# EasyEDA schematic Schematic_Z-Controller_v.1.0.0.json
TITLE: Z-Controller by KOE; REV: 1.0.0; Date: 2022-12-26; Sheet: 1/1; Drawn By: Romych; Company: zx-pk.ru
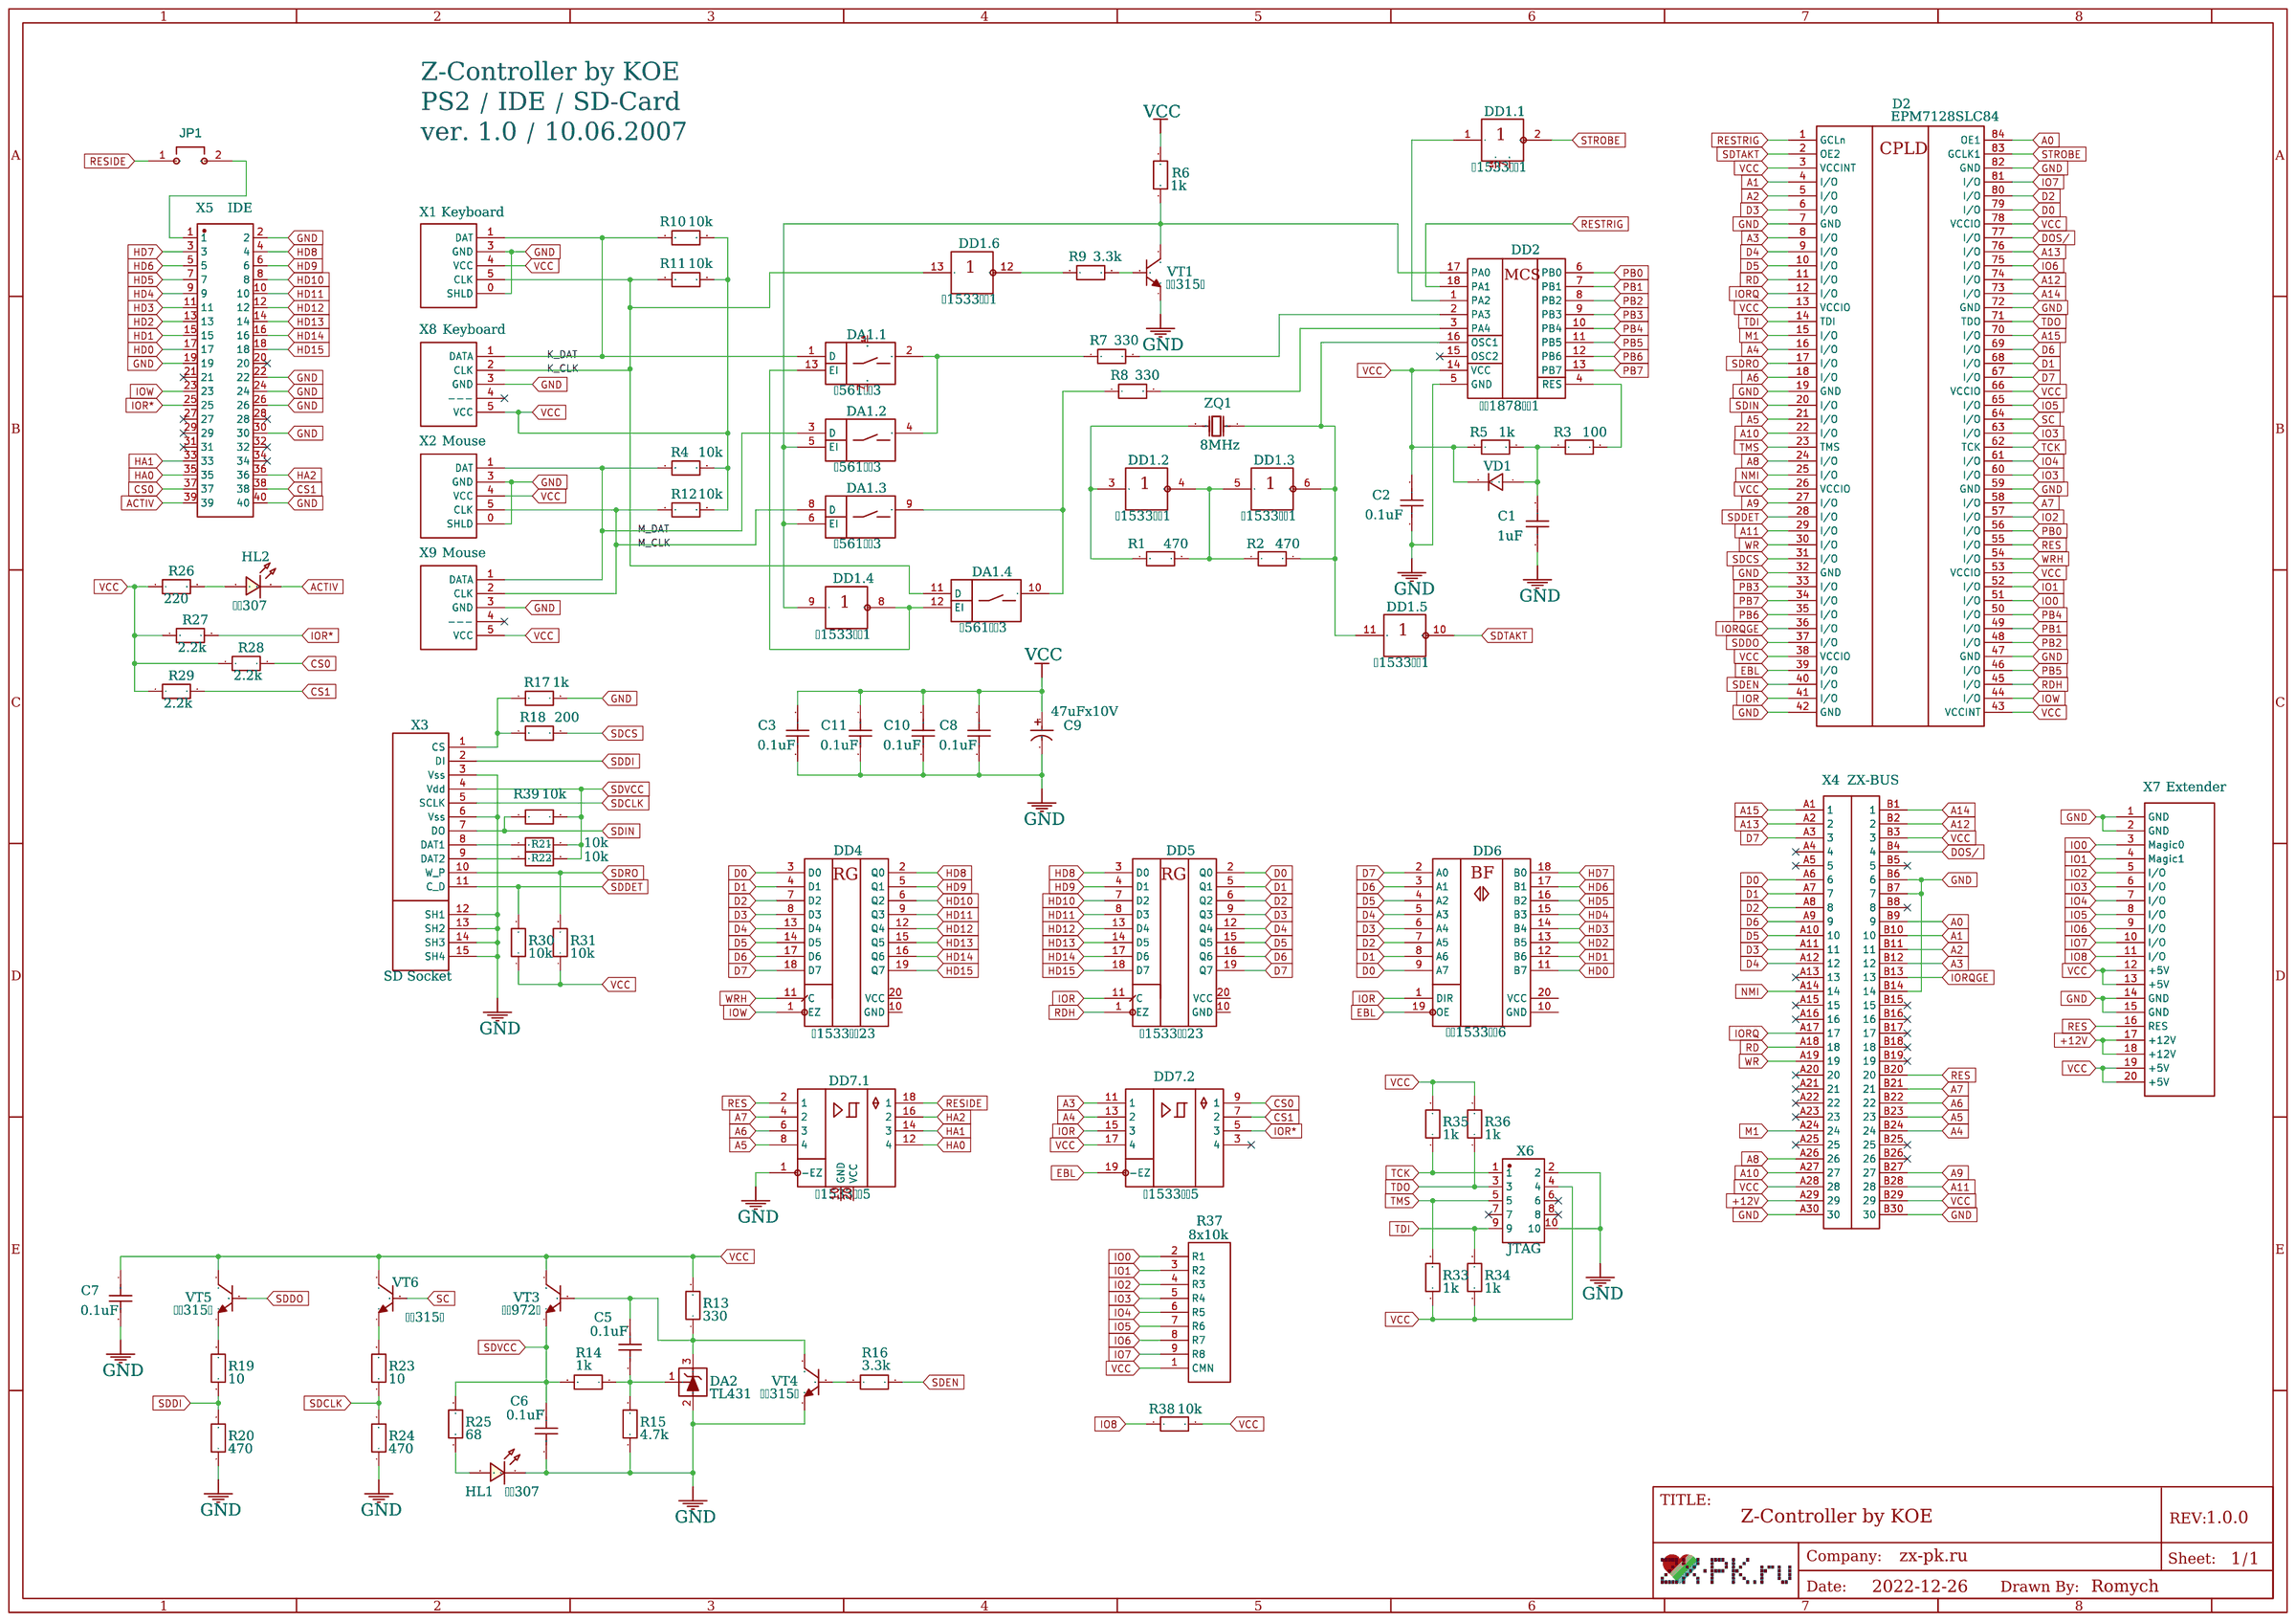
[diagram p0: schematic sheet]

## Parts
C1  1uF  [CAP-TH_L5.08]
C2  0.1uF  [CAP-TH_L5.08]
C3  0.1uF  [CAP-TH_L5.08]
C5  0.1uF  [CAP-TH_L5.08]
C6  0.1uF  [CAP-TH_L5.08]
C7  0.1uF  [CAP-TH_L5.08]
C8  0.1uF  [CAP-TH_L5.08]
C9  47uFx10V  [CAP-TH_BD6.3-P2.50-D1.0-FD]
C10  0.1uF  [CAP-TH_L5.08]
C11  0.1uF  [CAP-TH_L5.08]
D2  EPM7128SLC84  [PLCC-84-TH_STD]
DA1  К561КТ3  [DIP-14_STD]  (sections 1,2,3,4)
DA2  TL431  [TO-92-3_TL431_KOE]
DD1  К1533ЛН1  [DIP-14_STD]  (sections 1,2,3,4,5,6)
DD2  КР1878ВЕ1  [DIP-18_STD]
DD4  К1533ИР23  [DIP-20_STD]
DD5  К1533ИР23  [DIP-20_STD]
DD6  КР1533АП6  [DIP-20_STD]
DD7  К1533АП5  [DIP-20_STD]  (sections 1,2)
HL1  АЛ307  [D-TH_L2.54]
HL2  АЛ307  [D-TH_L2.54]
JP1  Jumper-2PM  [HDR-TH_2P-P2.54-V-M]
R1  470  [RES-TH_0.125_8.6]
R2  470  [RES-TH_0.125_8.6]
R3  100  [RES-TH_0.125_8.6]
R4  10k  [RES-TH_0.125_8.6]
R5  1k  [RES-TH_0.125_8.6]
R6  1k  [RES-TH_0.125_8.6]
R7  330  [RES-TH_0.125_8.6]
R8  330  [RES-TH_0.125_8.6]
R9  3.3k  [RES-TH_0.125_8.6]
R10  10k  [RES-TH_0.125_8.6]
R11  10k  [RES-TH_0.125_8.6]
R12  10k  [RES-TH_0.125_8.6]
R13  330  [RES-TH_0.125_8.6]
R14  1k  [RES-TH_0.125_8.6]
R15  4.7k  [RES-TH_0.125_8.6]
R16  3.3k  [RES-TH_0.125_8.6]
R17  1k  [RES-TH_0.125_8.6]
R18  200  [RES-TH_0.125_8.6]
R19  10  [RES-TH_0.125_8.6]
R20  470  [RES-TH_0.125_8.6]
R21  10k  [RES-TH_0.125_8.6]
R22  10k  [RES-TH_0.125_8.6]
R23  10  [RES-TH_0.125_8.6]
R24  470  [RES-TH_0.125_8.6]
R25  68  [RES-TH_0.125_8.6]
R26  220  [RES-TH_0.125_8.6]
R27  2.2k  [RES-TH_0.125_8.6]
R28  2.2k  [RES-TH_0.125_8.6]
R29  2.2k  [RES-TH_0.125_8.6]
R30  10k  [RES-TH_0.125_8.6]
R31  10k  [RES-TH_0.125_8.6]
R33  1k  [RES-TH_0.125_8.6]
R34  1k  [RES-TH_0.125_8.6]
R35  1k  [RES-TH_0.125_8.6]
R36  1k  [RES-TH_0.125_8.6]
R37  8x10k  [HDR-TH_9P-P2.54-V-F]
R38  10k  [RES-TH_0.125_8.6]
R39  10k  [RES-TH_0.125_8.6]
VD1  1N4148  [DIODE_TH_7.62]
VT1  КТ315Б  [KT315_STD]
VT3  КТ972Б  [KT315_STD]
VT4  КТ315Б  [KT315_STD]
VT5  КТ315Б  [KT315_STD]
VT6  КТ315Б  [KT315_STD]
X1  Keyboard  [PS2-TH_6P-KBD]
X2  Mouse  [PS2-TH_6P-KBD]
X3  SD Socket  [SD_SHORT]
X4  ZX-BUS  [SL60-SLOT-2.54-LONG]
X5  IDE  [CONN-TH_40P-P2.54_MTFD10-40B1]
X6  JTAG  [IDC-TH_10P-P2.54-V-R2-C5-S2.54]
X7  Extender  [HDR-TH_2X10P_P2.54]
X8  Keyboard  [HDR-TH_5P-P2.54]
X9  Mouse  [HDR-TH_5P-P2.54]
ZQ1  8MHz  [OSC-49U-1]

## Library data of the parts
C1-C3 C5-C8 C10 C11 = CK45-R3AD152K-VRY: Supplier: LCSC; Supplier Part: C340608; Manufacturer: TDK; Contributor: LCSC
C9 = ECLJ0612220M101P00: Supplier: LCSC; Supplier Part: C156809; Manufacturer: Guangdong TOPAZ Elec Tech; Contributor: LCSC
D2 = EPM7128SLC84: Supplier: chipdip; Contributor: romychs_4693
DA1 = К561КТ3: Supplier: chipdip; Contributor: romychs_4693; subpart_no: 1
DA2 = TL431ACLPREG: Supplier: LCSC; Supplier Part: C905425; Manufacturer: onsemi(安森美); link: https://atta.szlcsc.comnull; Contributor: LCSC
DD1 = К1533ЛН1: Supplier: chipdip; Contributor: Roman Boykov; subpart_no: 7
DD2 = КР1878ВЕ1: Supplier: chipdip; Contributor: Roman Boykov
DD4 DD5 = К1533ИР23: Supplier: chipdip; link: TTL; Регистр; ИР23; Contributor: romychs_4693
DD6 = КР1533АП6: Supplier: chipdip; Contributor: romychs_4693
DD7 = К1533АП5: Contributor: romychs_4693; subpart_no: 1
HL1 HL2 = LED-0603_R: Manufacturer: EVERLIGHT(台湾亿光); Manufacturer Part: 19-217/R6C-AL1M2VY/3T; Supplier Part: C72044; Supplier: LCSC; Contributor: LCEDA_01
JP1 = Jumper-2PM: Contributor: Roman Boykov
R1-R31 R33-R36 R38 R39 = RN 1/8W 470R F T/B A1: Supplier: LCSC; Supplier Part: C433478; Manufacturer: TyoHM; Contributor: LCSC
R37 = НР-8: Supplier: chipdip; Contributor: Roman Boykov
VD1 = 1N4148: Contributor: EasyEDA
VT1 VT3-VT6 = 2SC1815-TA: Supplier: LCSC; Manufacturer: CJ; image: //image.lceda.cn/szlcsc/C41114.jpg; Supplier Part: C41114; JLCPCB Part Class: Extended Part
X1 X2 = PS2-TH_STD: Supplier: chipdip; Contributor: Roman Boykov
X3 = SD_Socket_Short: Contributor: Roman Boykov
X4 = PinHeader_2x30: Contributor: Roman Boykov
X5 = MTFD10-40B1: Supplier: LCSC; Supplier Part: C376159; Manufacturer: MINTRON; Contributor: LCSC
X6 = X6521FV-2×05-C85D32: Supplier: LCSC; Supplier Part: C718231; Manufacturer: XKB Connectivity; Contributor: LCSC
X7 = PinHeader_2x10: Contributor: romychs_4693
X8 X9 = PinHeader_1x5: Contributor: Roman Boykov
ZQ1 = X49UD12MSD2SC: Supplier: LCSC; Manufacturer: YXC; Supplier Part: C2188

## Nets
+12V: X4.A29(29) X7.17(+12V) X7.18(+12V)
GND: C1.2 C2.2 C3.2 C6.2 C7.2 C8.2 C9.2 C10.2 C11.2 D2.7(GND) D2.19(GND) D2.32(GND) D2.42(GND) D2.47(GND) D2.59(GND) D2.72(GND) D2.82(GND) DA2.2(A) DD2.5(GND) DD7.1(-EZ) HL1.2 R15.1 R17.2 R20.1 R24.1 VT1.1(E) VT4.1(E) X1.0(SHLD) X1.3(GND) X2.0(SHLD) X2.3(GND) X3.3(Vss) X3.6(Vss) X3.12(SH1) X3.13(SH2) X3.14(SH3) X3.15(SH4) X4.A30(30) X4.B6(6) X4.B7(7) X4.B14(14) X4.B30(30) X5.2 X5.19 X5.22 X5.24 X5.26 X5.30 X5.40 X6.2 X6.10 X7.1(GND) X7.2(GND) X7.14(GND) X7.15(GND) X8.3(GND) X9.3(GND)
VCC: C2.1 C3.1 C7.1 C8.1 C9.1 C10.1 C11.1 D2.3(VCCINT) D2.13(VCCIO) D2.26(VCCIO) D2.38(VCCIO) D2.43(VCCINT) D2.53(VCCIO) D2.66(VCCIO) D2.78(VCCIO) DD2.14(VCC) DD7.17(4) R4.2 R5.1 R6.2 R10.2 R11.2 R12.2 R13.2 R26.1 R27.1 R28.1 R29.1 R30.1 R31.1 R33.1 R34.1 R35.2 R36.2 R37.1(CMN) R38.2 VD1.2(K) VT3.2(C) VT5.2(C) VT6.2(C) X1.4(VCC) X2.4(VCC) X4.A28(28) X4.B3(3) X4.B29(29) X6.4 X7.12(+5V) X7.13(+5V) X7.19(+5V) X7.20(+5V) X8.5(VCC) X9.5(VCC)
A0: D2.84(OE1) X4.B9(9)
A1: D2.4(I/O) X4.B10(10)
A2: D2.5(I/O) X4.B11(11)
A3: D2.8(I/O) DD7.11(1) X4.B12(12)
A4: D2.16(I/O) DD7.13(2) X4.B24(24)
A5: D2.21(I/O) DD7.8(4) X4.B23(23)
A6: D2.18(I/O) DD7.6(3) X4.B22(22)
A7: D2.58(I/O) DD7.4(2) X4.B21(21)
A8: D2.24(I/O) X4.A26(26)
A9: D2.27(I/O) X4.B27(27)
A10: D2.22(I/O) X4.A27(27)
A11: D2.29(I/O) X4.B28(28)
A12: D2.74(I/O) X4.B2(2)
A13: D2.76(I/O) X4.A2(2)
A14: D2.73(I/O) X4.B1(1)
A15: D2.70(I/O) X4.A1(1)
ACTIV: HL2.2 X5.39
CS0: DD7.9(1) R28.2 X5.37
CS1: DD7.7(2) R29.2 X5.38
D0: D2.79(I/O) DD4.3(D0) DD5.2(Q0) DD6.9(A7) X4.A6(6)
D1: D2.68(I/O) DD4.4(D1) DD5.5(Q1) DD6.8(A6) X4.A7(7)
D2: D2.80(I/O) DD4.7(D2) DD5.6(Q2) DD6.7(A5) X4.A8(8)
D3: D2.6(I/O) DD4.8(D3) DD5.9(Q3) DD6.6(A4) X4.A11(11)
D4: D2.9(I/O) DD4.13(D4) DD5.12(Q4) DD6.5(A3) X4.A12(12)
D5: D2.10(I/O) DD4.14(D5) DD5.15(Q5) DD6.4(A2) X4.A10(10)
D6: D2.69(I/O) DD4.17(D6) DD5.16(Q6) DD6.3(A1) X4.A9(9)
D7: D2.67(I/O) DD4.18(D7) DD5.19(Q7) DD6.2(A0) X4.A3(3)
DOS/: D2.77(I/O) X4.B4(4)
EBL: D2.39(I/O) DD6.19(OE) DD7.19(-EZ)
HA0: DD7.12(4) X5.35
HA1: DD7.14(3) X5.33
HA2: DD7.16(2) X5.36
HD0: DD6.11(B7) X5.17
HD1: DD6.12(B6) X5.15
HD2: DD6.13(B5) X5.13
HD3: DD6.14(B4) X5.11
HD4: DD6.15(B3) X5.9
HD5: DD6.16(B2) X5.7
HD6: DD6.17(B1) X5.5
HD7: DD6.18(B0) X5.3
HD8: DD4.2(Q0) DD5.3(D0) X5.4
HD9: DD4.5(Q1) DD5.4(D1) X5.6
HD10: DD4.6(Q2) DD5.7(D2) X5.8
HD11: DD4.9(Q3) DD5.8(D3) X5.10
HD12: DD4.12(Q4) DD5.13(D4) X5.12
HD13: DD4.15(Q5) DD5.14(D5) X5.14
HD14: DD4.16(Q6) DD5.17(D6) X5.16
HD15: DD4.19(Q7) DD5.18(D7) X5.18
IO0: D2.51(I/O) R37.2(R1) X7.3(Magic0)
IO1: D2.52(I/O) R37.3(R2) X7.4(Magic1)
IO2: D2.57(I/O) R37.4(R3) X7.5(I/O)
IO3: D2.60(I/O) D2.63(I/O) R37.5(R4) X7.6(I/O)
IO4: D2.61(I/O) R37.6(R5) X7.7(I/O)
IO5: D2.65(I/O) R37.7(R6) X7.8(I/O)
IO6: D2.75(I/O) R37.8(R7) X7.9(I/O)
IO7: D2.81(I/O) R37.9(R8) X7.10(I/O)
IO8: R38.1 X7.11(I/O)
IOR: D2.41(I/O) DD5.11(C) DD6.1(DIR) DD7.15(3)
IOR*: DD7.5(3) R27.2 X5.25
IORQ: D2.12(I/O) X4.A17(17)
IORQGE: D2.36(I/O) X4.B13(13)
IOW: D2.44(I/O) DD4.1(EZ) X5.23
K_CLK: DA1.11(D) DD1.13(1) R11.1 X1.5(CLK) X8.2(CLK)
K_DAT: DA1.1(D) R10.1 X1.1(DAT) X8.1(DATA)
M1: D2.15(I/O) X4.A24(24)
M_CLK: DA1.8(D) R12.1 X2.5(CLK) X9.2(CLK)
M_DAT: DA1.3(D) R4.1 X2.1(DAT) X9.1(DATA)
NMI: D2.25(I/O) X4.A14(14)
PB0: D2.56(I/O) DD2.6(PB0)
PB1: D2.49(I/O) DD2.7(PB1)
PB2: D2.48(I/O) DD2.8(PB2)
PB3: D2.33(I/O) DD2.9(PB3)
PB4: D2.50(I/O) DD2.10(PB4)
PB5: D2.46(I/O) DD2.11(PB5)
PB6: D2.35(I/O) DD2.12(PB6)
PB7: D2.34(I/O) DD2.13(PB7)
RD: D2.11(I/O) X4.A18(18)
RDH: D2.45(I/O) DD5.1(EZ)
RES: D2.55(I/O) DD7.2(1) X4.B20(20) X7.16(RES)
RESIDE: DD7.18(1) JP1.1
RESTRIG: D2.1(GCLn) DD2.18(PA1)
SC: D2.64(I/O) VT6.3(B)
SDCLK: R23.1 R24.2 X3.5(SCLK)
SDCS: D2.31(I/O) R18.2
SDDET: D2.28(I/O) R30.2 X3.11(C_D)
SDDI: R19.1 R20.2 X3.2(DI)
SDDO: D2.37(I/O) VT5.3(B)
SDEN: D2.40(I/O) R16.1
SDIN: D2.20(I/O) R39.1 X3.7(DO)
SDRO: D2.17(I/O) R31.2 X3.10(W_P)
SDTAKT: D2.2(OE2) DD1.10(2)
SDVCC: C6.1 R14.2 R21.2 R22.2 R25.2 R39.2 VT3.1(E) X3.4(Vdd)
STROBE: D2.83(GCLK1) DD1.2
TCK: D2.62(TCK) R35.1 X6.1
TDI: D2.14(TDI) R34.2 X6.9
TDO: D2.71(TDO) R36.1 X6.3
TMS: D2.23(TMS) R33.2 X6.5
WR: D2.30(I/O) X4.A19(19)
WRH: D2.54(I/O) DD4.11(C)
Net-(C1-1): C1.1 R3.1 R5.2 VD1.1(A)
Net-(C5-1): C5.1 DA2.3(K) R13.1 VT3.3(B) VT4.2(C)
Net-(C5-2): C5.2 DA2.1(R) R14.1 R15.2
Net-(DA1.1-2): DA1.2(O) DA1.4(O) R7.1
Net-(DA1.1-13): DA1.12(EI) DA1.13(EI) DD1.8(2)
Net-(DA1.2-5): DA1.5(EI) DA1.6(EI) DD1.9(1) DD2.17(PA0) R6.1 VT1.2(C)
Net-(DA1.3-9): DA1.9(O) DA1.10(O) R8.1
Net-(DD1.1-1): DD1.1 DD2.1(PA2)
Net-(DD1.2-3): DD1.3(1) R1.1 ZQ1.2(OSC2)
Net-(DD1.2-4): DD1.4(2) DD1.5(1) R1.2 R2.1
Net-(DD1.3-6): DD1.6(2) DD1.11(1) DD2.16(OSC1) R2.2 ZQ1.1(OSC1)
Net-(DD1.6-12): DD1.12(2) R9.1
Net-(DD2-2): DD2.2(PA3) R7.2
Net-(DD2-3): DD2.3(PA4) R8.2
Net-(DD2-4): DD2.4(RES) R3.2
Net-(HL1-1): HL1.1 R25.1
Net-(HL2-1): HL2.1 R26.2
Net-(JP1-2): JP1.2 X5.1
Net-(R9-2): R9.2 VT1.3(B)
Net-(R16-2): R16.2 VT4.3(B)
Net-(R17-1): R17.1 R18.1 X3.1(CS)
Net-(R19-2): R19.2 VT5.1(E)
Net-(R21-1): R21.1 X3.8(DAT1)
Net-(R22-1): R22.1 X3.9(DAT2)
Net-(R23-2): R23.2 VT6.1(E)

Not connected (* = marked no-connect by the designer): DA1 7(GND) 14(VCC); DD1 7(GND) 14(VCC); DD2 15(OSC2)*; DD4 10(GND) 20(VCC); DD5 10(GND) 20(VCC); DD6 10(GND) 20(VCC); DD7 3(4)* 10(GND) 20(VCC); X4 A4(4)* A5(5)* A13(13)* A15(15)* A16(16)* A20(20)* A21(21)* A22(22)* A23(23)* A25(25)* B5(5)* B8(8)* B15(15)* B16(16)* B17(17)* B18(18)* B19(19)* B25(25)* B26(26)*; X5 20* 21* 27* 28* 29* 31* 32* 34*; X6 6* 7* 8*; X8 4(---)*; X9 4(---)*

## Notes on the sheet
- Z-Controller by KOE
  PS2 / IDE / SD-Card
  ver. 1.0 / 10.06.2007
